# Altium schematic sheet Connector.SchDoc
size A4
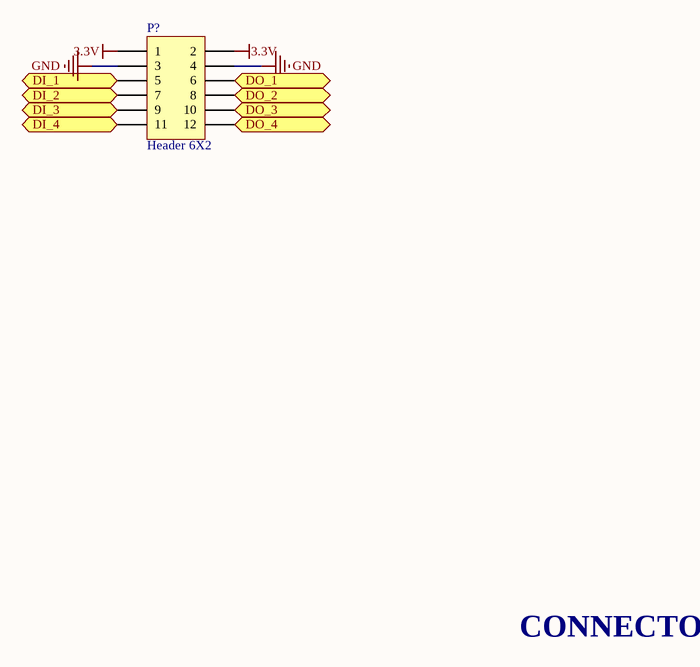
[diagram p0: Connector.SchDoc]

## Parts
P?  Header 6X2  [HDR2X6]

## Ports
DI_1, DI_2, DI_3, DI_4, DO_1, DO_2, DO_3, DO_4

## Nets
3.3V: P?.1 P?.2
GND: P?.3 P?.4
DI_1: P?.5 ; port DI_1
DI_2: P?.7 ; port DI_2
DI_3: P?.9 ; port DI_3
DI_4: P?.11 ; port DI_4
DO_1: P?.6 ; port DO_1
DO_2: P?.8 ; port DO_2
DO_3: P?.10 ; port DO_3
DO_4: P?.12 ; port DO_4

## Notes on the sheet
- CONNECTOR

## Library data of the parts
P? = Header 6X2: CONNECTOR Header, 6-Pin, Dual row; LatestRevisionDate: 17-Jul-2002; LatestRevisionNote: Re-released for DXP Platform.; Publisher: Altium Limited